# EAGLE design Tea Cabinet (EAGLE 7.4.0)
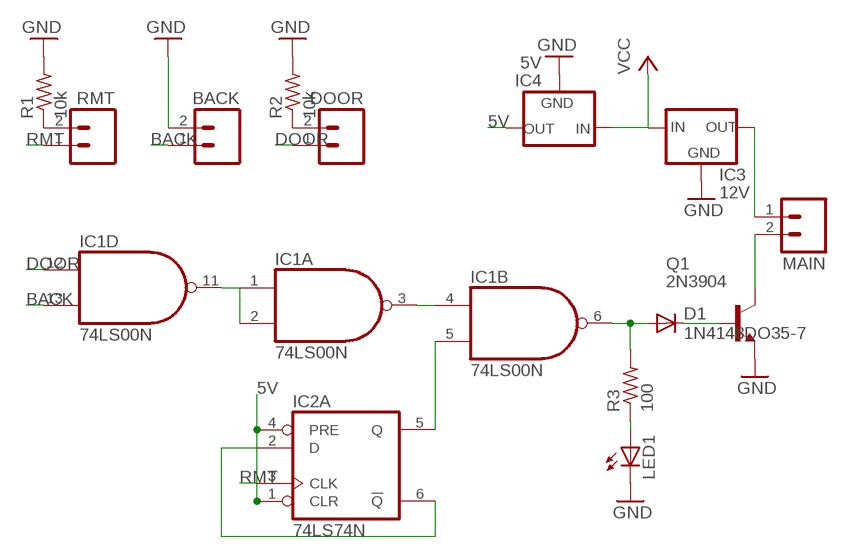
[diagram p0: schematic, sheet 1]

## Parts
BACK  M02PTH  [1X02]
D1  1N4148DO35-7  [DO35-7]
DOOR  M02PTH  [1X02]
IC1  74LS00N  [DIL14]
IC2  74LS74N  [DIL14]
IC3  12V  78XXS  [78XXS]
IC4  5V  78XXS  [78XXS]
LED1  LED5MM  [LED5MM]
MAIN  M02PTH  [1X02]
Q1  2N3904  [TO92]
R1  10k  R-US_0204/5  [0204/5]
R2  10k  R-US_0204/5  [0204/5]
R3  100  R-US_0204/5  [0204/5]
RMT  M02PTH  [1X02]

## Nets
5V: IC2.1(A:CLR) IC2.4(A:PRE) IC4.OUT
12V: IC3.OUT MAIN.1
BACK: BACK.1 IC1.13(D:I1)
DOOR: DOOR.1 IC1.12(D:I0)
GND: BACK.2 IC3.GND IC4.GND LED1.K(C) Q1.3(E) R1.2 R2.2
N$1: LED1.A R3.1
N$2: MAIN.2 Q1.1(C)
N$3: D1.C Q1.2(B)
N$4: R1.1 RMT.2
N$5: IC1.1(A:I0) IC1.2(A:I1) IC1.11(D:O)
N$6: D1.A IC1.6(B:O) R3.2
N$7: DOOR.2 R2.1
N$8: IC2.2(A:D) IC2.6(A:!Q)
N$9: IC1.5(B:I1) IC2.5(A:Q)
N$10: IC1.3(A:O) IC1.4(B:I0)
RMT: IC2.3(A:CLK) RMT.1
VCC: IC3.IN IC4.IN
Unconnected: IC1.8(C:O) IC1.9(C:I0) IC1.10(C:I1) IC2.8(B:!Q) IC2.9(B:Q) IC2.10(B:PRE) IC2.11(B:CLK) IC2.12(B:D) IC2.13(B:CLR)

## Power pins joined to a net without a drawn wire
GND: IC1.7(P:GND) IC2.7(P:GND)
VCC: IC1.14(P:VCC) IC2.14(P:VCC)

## Library data of the parts
BACK DOOR MAIN RMT = SparkFun:M02: Header 2 Standard 2-pin 0.1" header. Use with straight break away headers (SKU : PRT-00116), right angle break away headers (PRT-00553), swiss pins (PRT-00743), machine pins (PRT-00117), and female headers (PRT-00115). Molex polarized connector foot print use with SKU : PRT-08233 with associated crimp pins and housings.
D1 = diode:1N4148: DIODE high speed (Philips)
IC1 = 74xx-us:74*00: Quad 2-input NAND gate
IC2 = 74xx-us:74*74: Dual D type positive edge triggered FLIP FLOP, preset and clear
IC3 IC4 = v-reg:78XXS: VOLTAGE REGULATOR
LED1 = led:LED: LED OSRAM: - CHIPLED LG R971, LG N971, LY N971, LG Q971, LY Q971, LO R971, LY R971 LH N974, LH R974 LS Q976, LO Q976, LY Q976 LO Q996 - Hyper CHIPLED LW Q18S LB Q993, LB Q99A, LB R99A - SideLED LS A670, LO A670, LY A670, LG A670, LP A670 LB A673, LV A673, LT A673, LW A673 LH A674 LY A675 LS A676, LA A676, LO A676, LY A676, LW A676 LS A679, LY A679, LG A679 - Hyper Micro SIDELED® LS Y876, LA Y876, LO Y876, LY Y876 LT Y87S - SmartLED LW L88C, LW L88S LB L89C, LB L89S, LG L890 LS L89K, LO L89K, LY L89K LS L896, LA L896, LO L896, LY L896 - TOPLED LS T670, LO T670, LY T670, LG T670, LP T670 LSG T670, LSP T670, LSY T670, LOP T670, LYG T670 LG T671, LOG T671, LSG T671 LB T673, LV T673, LT T673, LW T673 LH T674 LS T676, LA T676, LO T676, LY T676, LB T676, LH T676, LSB T676, LW T676 LB T67C, LV T67C, LT T67C, LS T67K, LO T67K, LY T67K, LW E67C LS E67B, LA E67B, LO E67B, LY E67B, LB E67C, LV E67C, LT E67C LW T67C LS T679, LY T679, LG T679 LS T770, LO T770, LY T770, LG T770, LP T770 LB T773, LV T773, LT T773, LW T773 LH T774 LS E675, LA E675, LY E675, LS T675 LS T776, LA T776, LO T776, LY T776, LB T776 LHGB T686 LT T68C, LB T68C - Hyper Mini TOPLED® LB M676 - Mini TOPLED Santana® LG M470 LS M47K, LO M47K, LY M47K Source: http://www.osram.convergy.de LUXEON: - LUMILED® LXK2-PW12-R00, LXK2-PW12-S00, LXK2-PW14-U00, LXK2-PW14-V00 LXK2-PM12-R00, LXK2-PM12-S00, LXK2-PM14-U00 LXK2-PE12-Q00, LXK2-PE12-R00, LXK2-PE12-S00, LXK2-PE14-T00, LXK2-PE14-U00 LXK2-PB12-K00, LXK2-PB12-L00, LXK2-PB12-M00, LXK2-PB14-N00, LXK2-PB14-P00, LXK2-PB14-Q00 LXK2-PR12-L00, LXK2-PR12-M00, LXK2-PR14-Q00, LXK2-PR14-R00 LXK2-PD12-Q00, LXK2-PD12-R00, LXK2-PD12-S00 LXK2-PH12-R00, LXK2-PH12-S00 LXK2-PL12-P00, LXK2-PL12-Q00, LXK2-PL12-R00 Source: www.luxeon.com KINGBRIGHT: KA-3528ASYC Source: www.kingbright.com
Q1 = transistor-npn:2N3904: NPN Transistor
R1-R3 = resistor:R-US_: RESISTOR, American symbol

## Board
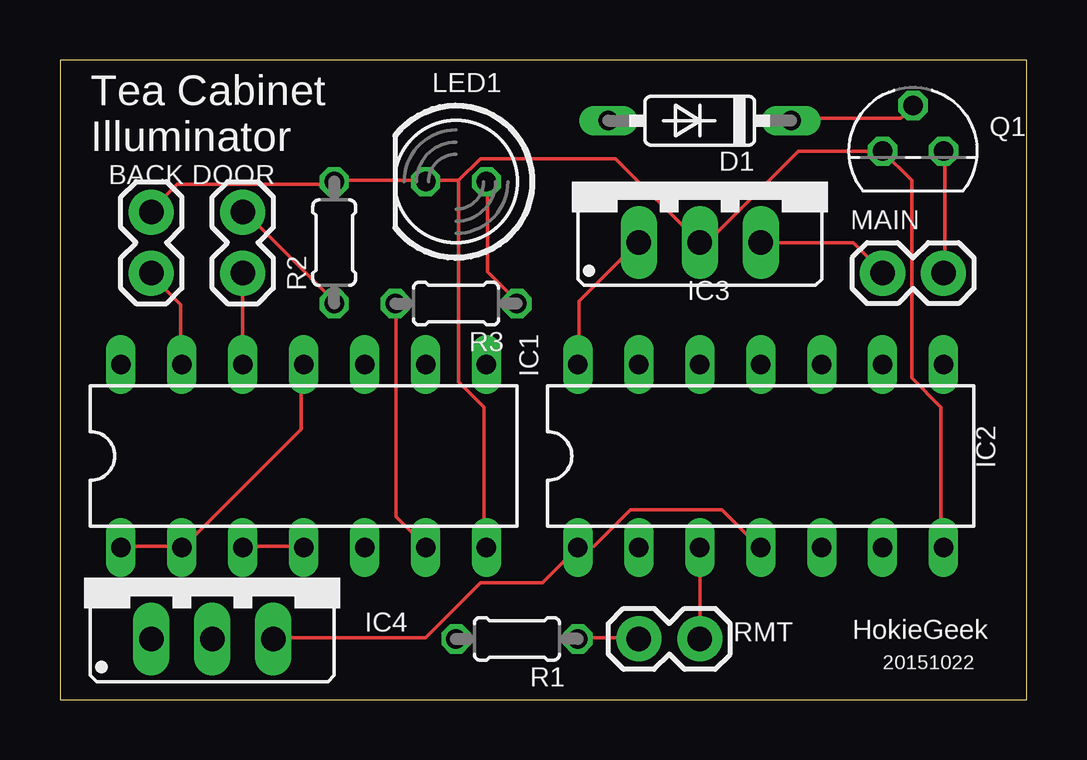
[diagram p1: board, top side]
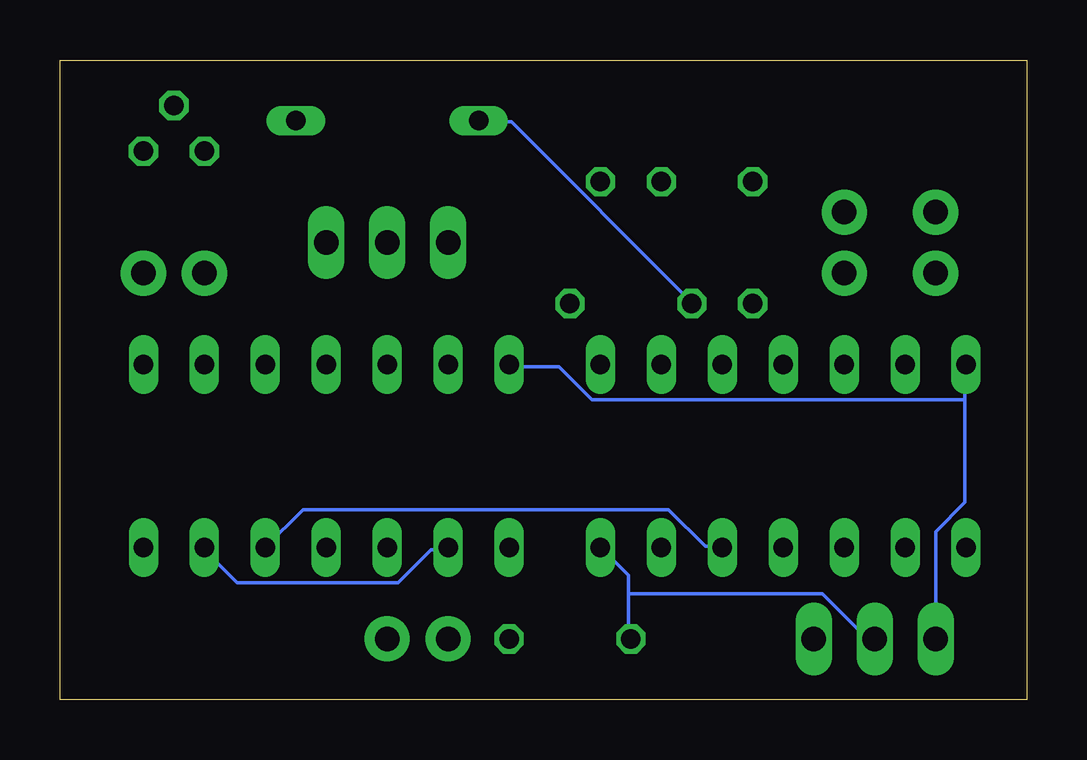
[diagram p2: board, bottom side, seen from below]

Size 40.31 x 26.66 mm. Coordinates in mm from the lower left corner, seen from the top.
Outline: 0,0 40.31,0 40.31,26.66 0,26.66 0,0
Copper layers (1*16): Top 0.0356mm / dielectric 1.5011mm / Bottom 0.0356mm
Design rules "LaenPCBOrder": minimum track width 6mil, minimum drill 13mil, track to track 6mil, track to pad 6mil, pad to pad 6mil, via to via 6mil, smd to smd 6mil, copper to edge 15mil, drill to drill 6mil, minimum pad ring 7mil, minimum via ring 7mil, stop-mask expansion 3mil, vias tented up to drill 0mil, thermal gap 10mil

### Footprints (pad centres in the part's own frame; a part is rotated, then mirrored left to right if it is on the bottom)
1X02 = drill 1.016 pad 1.88: 1 0,0; 2 2.54,0
DO35-7 = drill 0.813 long: A 3.81,0; C -3.81,0
DIL14 = drill 0.813 long: 1 -7.62,-3.81; 2 -5.08,-3.81; 3 -2.54,-3.81; 4 0,-3.81; 5 2.54,-3.81; 6 5.08,-3.81; 7 7.62,-3.81; 8 7.62,3.81; 9 5.08,3.81; 10 2.54,3.81; 11 0,3.81; 12 -2.54,3.81; 13 -5.08,3.81; 14 -7.62,3.81
78XXS = drill 1.016 long: GND 0,-2.54; IN -2.54,-2.54; OUT 2.54,-2.54
LED5MM = drill 0.813 octagon: A -1.27,0; K 1.27,0
TO92 = drill 0.813 octagon: 1 1.27,0; 2 0,1.905; 3 -1.27,0
0204/5 = drill 0.813 octagon: 1 -2.54,0; 2 2.54,0

### Placement (x,y rotation side)
BACK  3.81,17.78 90 top
D1  26.67,24.13 180 top
DOOR  7.62,17.78 90 top
IC1  10.16,10.16 0 top
IC2  29.21,10.16 0 top
IC3  26.67,21.59 0 top
IC4  6.35,5.08 0 top
LED1  16.51,21.59 180 top
MAIN  34.29,17.78 0 top
Q1  35.56,22.86 0 top
R1  19.05,2.54 180 top
R2  11.43,19.05 90 top
R3  16.51,16.51 180 top
RMT  26.67,2.54 180 top

### Tracks (layer width: path | path; a pad name or v marks a point on that pad's centre or on a via)
5V
  Top 0.152: IC2.4 29.11,6.4 27.58,7.92 23.77,7.92 22.25,6.4 21.64,6.4 IC2.1 20.12,4.88 17.53,4.88 15.24,2.59 8.99,2.59 IC4.OUT
12V
  Top 0.152: IC3.OUT 33.07,19.05 34.29,17.83 MAIN.1
BACK
  Top 0.152: IC1.13 5.03,14.02 5.03,16.46 3.81,17.68 BACK.1
DOOR
  Top 0.152: DOOR.1 IC1.12
GND
  Top 0.152: 15.24,21.64 11.43,21.64 R2.2 11.43,21.49 4.88,21.49 3.81,20.42 BACK.2 | IC2.7 36.73,6.4 36.73,12.19 35.51,13.41 35.51,21.64 Q1.3 30.79,22.86 26.98,19.05 IC3.GND 23.16,22.55 17.53,22.55 16.61,21.64 | 16.61,21.64 15.24,21.64 | 15.24,21.64 LED1.K | 16.61,21.64 16.61,13.26 17.68,12.19 17.68,6.4 IC1.7
  Bottom 0.152: 16.61,4.42 16.61,5.18 IC1.7 | 16.61,4.42 16.61,2.59 R1.2 | 16.61,4.42 8.53,4.42 6.71,2.59 6.4,2.59 IC4.GND
N$1
  Top 0.152: LED1.A 17.83,21.49 17.83,17.83 19.05,16.61 R3.1
N$2
  Top 0.152: Q1.1 36.88,22.86 36.88,17.83 MAIN.2
N$3
  Top 0.152: D1.C 30.48,24.23 35.05,24.23 35.51,24.69 Q1.2
N$4
  Top 0.152: R1.1 21.64,2.59 24.08,2.59 RMT.2
N$5
  Top 0.152: IC1.1 2.59,6.4 5.03,6.4 IC1.2 5.18,6.4 10.06,11.28 10.06,13.87 IC1.11
N$6
  Top 0.152: R3.2 14.02,16.46 14.02,7.62 15.24,6.4 IC1.6
  Bottom 0.152: D1.A 22.86,24.08 21.49,24.08 14.02,16.61 R3.2
N$7
  Top 0.152: R2.1 11.43,16.61 7.62,20.42 DOOR.2
N$8
  Bottom 0.152: IC2.2 24.23,6.25 24.84,6.25 26.21,4.88 32.92,4.88 34.29,6.25 IC2.6
N$9
  Bottom 0.152: IC2.5 30.18,7.92 14.94,7.92 13.41,6.4 12.8,6.4 IC1.5
N$10
  Top 0.152: IC1.3 7.62,6.4 10.06,6.4 IC1.4
RMT
  Top 0.152: RMT.1 IC2.3
VCC
  Top 0.152: IC2.14 21.64,14.02 21.64,16.61 24.08,19.05 IC3.IN
  Bottom 0.152: 2.59,12.5 2.59,8.23 3.81,7.01 IC4.IN | 2.59,12.5 2.59,13.87 IC1.14 | 2.59,12.5 18.14,12.5 19.51,13.87 21.49,13.87 IC2.14

### Text on the board
tPlace: Tea Cabinet / Illuminator | HokieGeek | 20151022